# EAGLE design top5v (EAGLE 7.1.0)
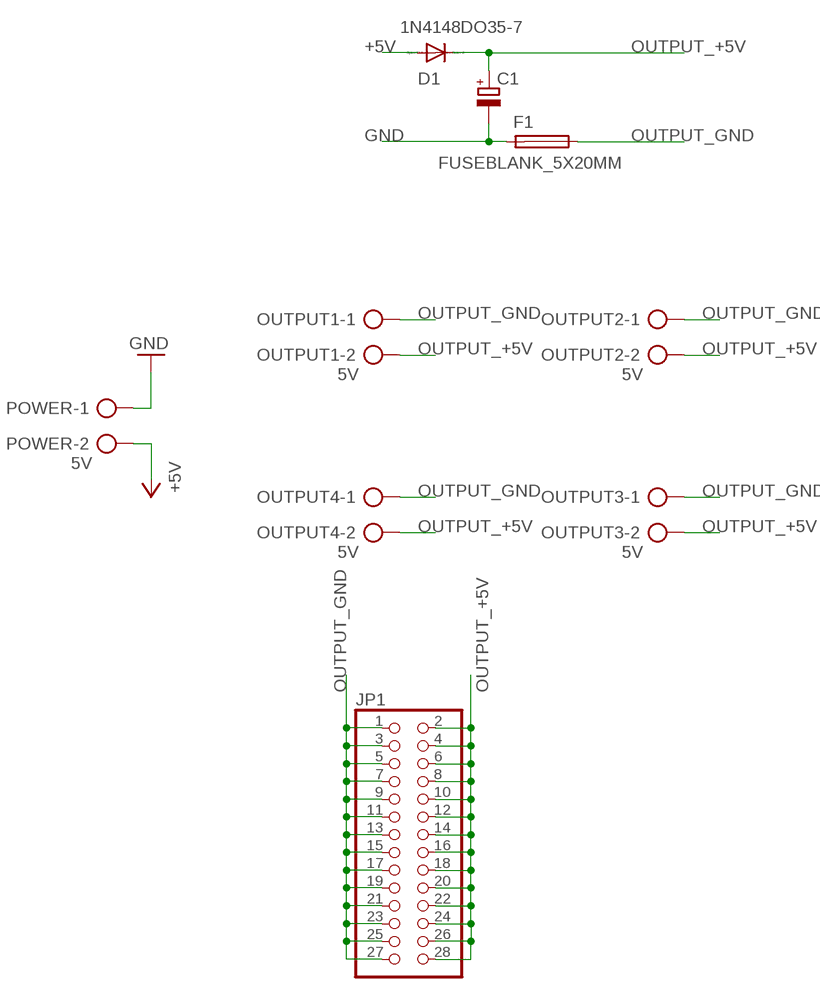
[diagram p0: schematic, sheet 1]

## Parts
C1  CPOL-EUE1.8-4  [E1,8-4]
D1  1N4148DO35-7  [DO35-7]
F1  FUSEBLANK_5X20MM  [FUSE_HOLDER_5X20MM]
JP1  PINHD-2X14  [2X14]
OUTPUT1  5V  AK500/2-H  [AK500/2-H]
OUTPUT2  5V  AK500/2-H  [AK500/2-H]
OUTPUT3  5V  AK500/2-H  [AK500/2-H]
OUTPUT4  5V  AK500/2-H  [AK500/2-H]
POWER  5V  AK500/2-H  [AK500/2-H]

## Nets
+5V: D1.A POWER.2
GND: C1.- F1.2 POWER.1
OUTPUT_+5V: C1.+ D1.C JP1.2 JP1.4 JP1.6 JP1.8 JP1.10 JP1.12 JP1.14 JP1.16 JP1.18 JP1.20 JP1.22 JP1.24 JP1.26 JP1.28 OUTPUT1.2 OUTPUT2.2 OUTPUT3.2 OUTPUT4.2
OUTPUT_GND: F1.1 JP1.1 JP1.3 JP1.5 JP1.7 JP1.9 JP1.11 JP1.13 JP1.15 JP1.17 JP1.19 JP1.21 JP1.23 JP1.25 JP1.27 OUTPUT1.1 OUTPUT2.1 OUTPUT3.1 OUTPUT4.1

## Library data of the parts
C1 = resistor:CPOL-EU: POLARIZED CAPACITOR, European symbol
D1 = diode:1N4148: DIODE high speed (Philips)
F1 = fuse:FUSE: Fuse; OC_FARNELL: unknown; OC_NEWARK: unknown
JP1 = pinhead:PINHD-2X14: PIN HEADER
OUTPUT1-OUTPUT4 POWER = con-ptr500:AK500/2-H: CONNECTOR Aug. 2004 / PTR Meßtechnik: Die Bezeichnung der Serie AK505 wurde geändert. Es handelt sich hierbei um AK500 in horizontaler Ausführung.; OC_FARNELL: unknown; OC_NEWARK: unknown

## Board
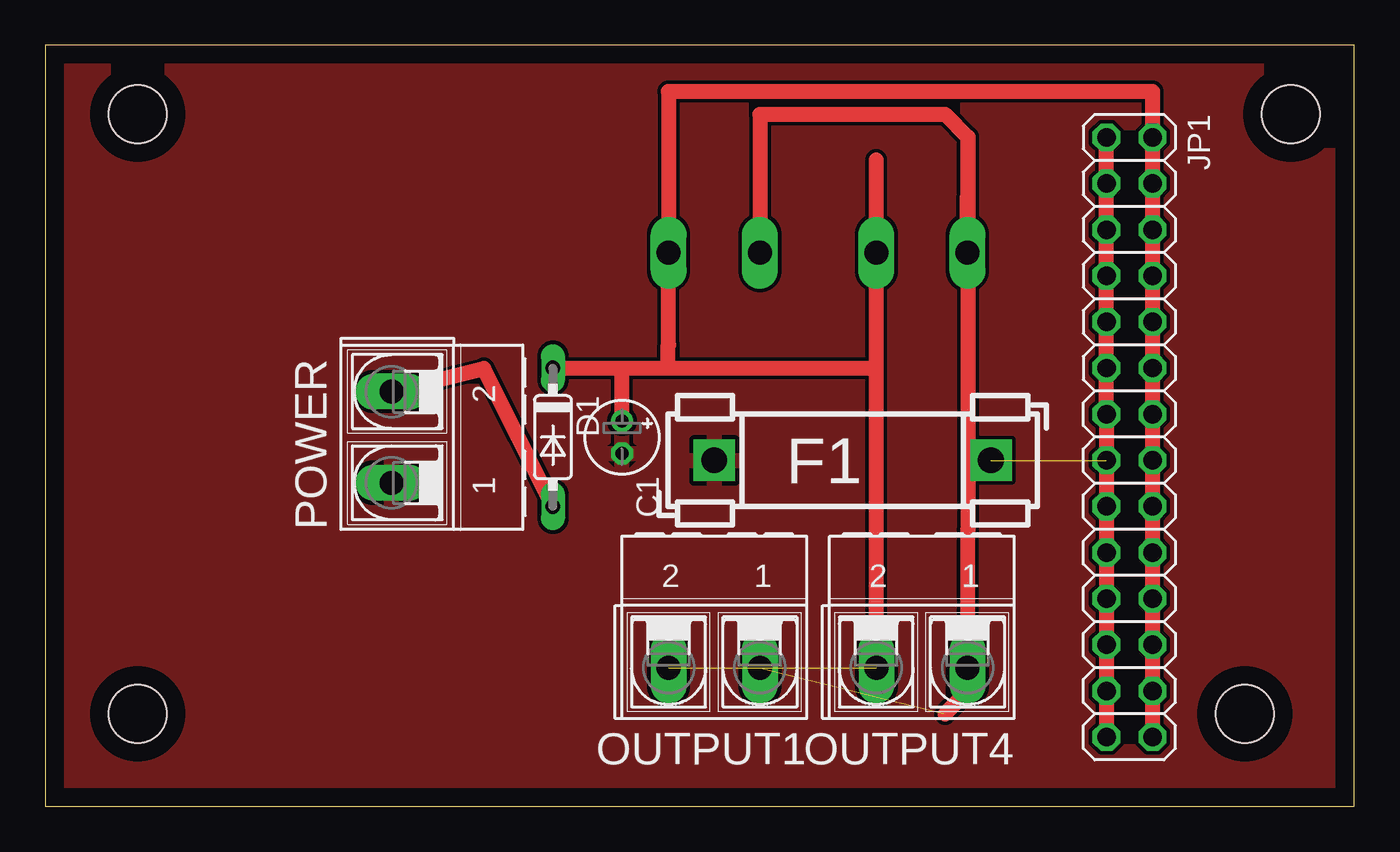
[diagram p1: board, top side]
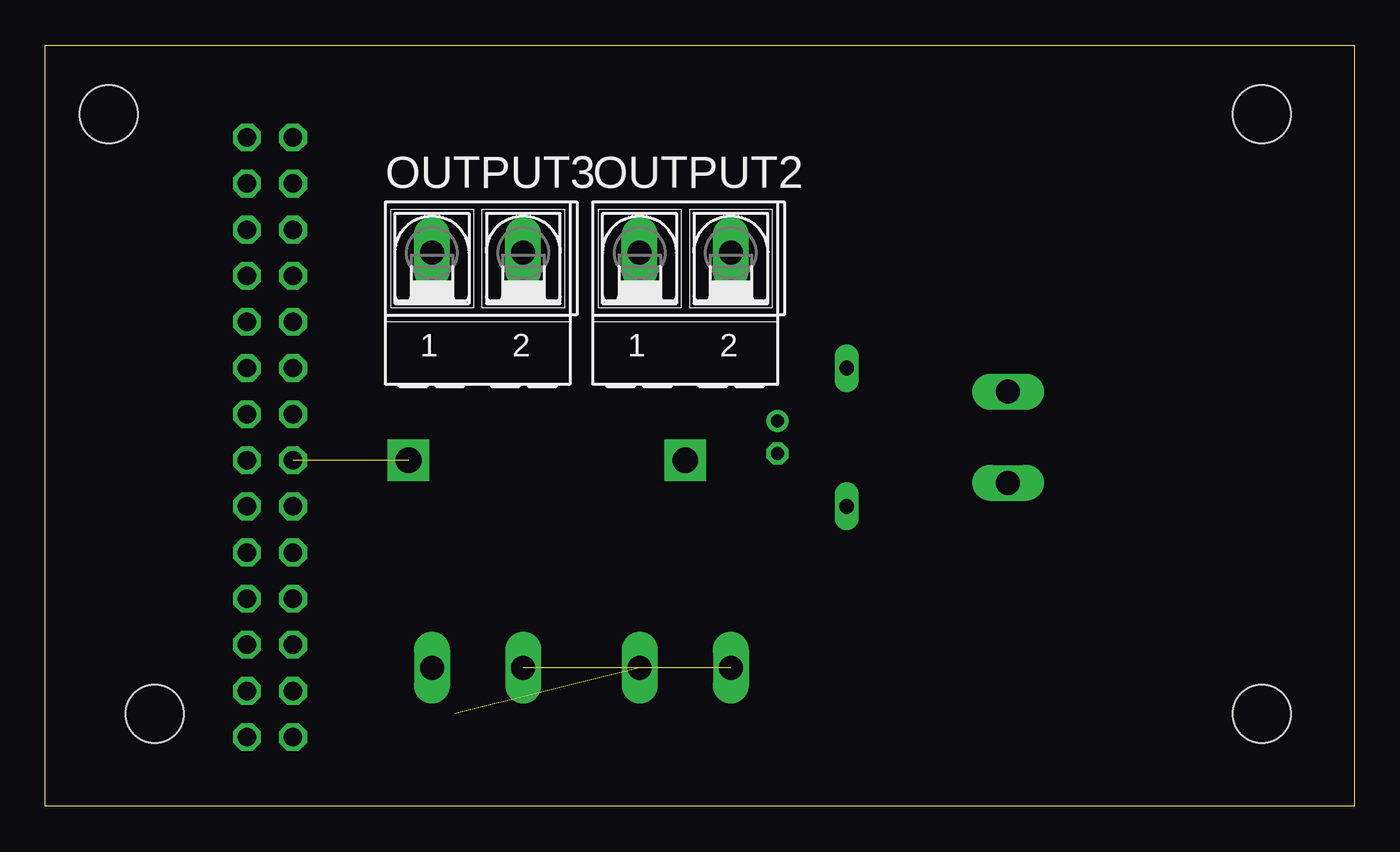
[diagram p2: board, bottom side, seen from below]

Size 72.06 x 41.9 mm. Coordinates in mm from the lower left corner, seen from the top.
Outline: 0,0 72.06,0 72.06,41.9 0,41.9 0,0
Copper layers (1*16): Top 0.035mm / dielectric 1.5mm / Bottom 0.035mm
Design rules "default": minimum track width 10mil, minimum drill 24mil, track to track 8mil, track to pad 8mil, pad to pad 8mil, via to via 8mil, smd to smd 8mil, copper to edge 40mil, drill to drill 8mil, minimum pad ring 10mil, minimum via ring 8mil, stop-mask expansion 4mil, vias tented up to drill 0mil, thermal gap 10mil
Holes 3.2 mm at 5.08,38.1 5.08,5.08 66.04,5.08 68.58,38.1

### Footprints (pad centres in the part's own frame; a part is rotated, then mirrored left to right if it is on the bottom)
E1,8-4 = drill 0.711 pad 1.168: + -0.889,0 | drill 0.711 pad 1.168 octagon: - 0.889,0
DO35-7 = drill 0.813 long: A 3.81,0; C -3.81,0
FUSE_HOLDER_5X20MM = drill 1.422 pad 2.286 square: 1 0,0; 2 15.24,0
2X14 = drill 1.016 octagon: 1 -16.51,-1.27; 2 -16.51,1.27; 3 -13.97,-1.27; 4 -13.97,1.27; 5 -11.43,-1.27; 6 -11.43,1.27; 7 -8.89,-1.27; 8 -8.89,1.27; 9 -6.35,-1.27; 10 -6.35,1.27; 11 -3.81,-1.27; 12 -3.81,1.27; 13 -1.27,-1.27; 14 -1.27,1.27; 15 1.27,-1.27; 16 1.27,1.27; 17 3.81,-1.27; 18 3.81,1.27; 19 6.35,-1.27; 20 6.35,1.27; 21 8.89,-1.27; 22 8.89,1.27; 23 11.43,-1.27; 24 11.43,1.27; 25 13.97,-1.27; 26 13.97,1.27; 27 16.51,-1.27; 28 16.51,1.27
AK500/2-H = drill 1.321 long: 1 -2.515,0; 2 2.515,0

### Placement (x,y rotation side)
C1  31.75,20.32 270 top
D1  27.94,20.32 270 top
F1  52.07,19.05 180 top
JP1  59.69,20.32 270 top
OUTPUT1  36.83,7.62 180 top
OUTPUT2  36.83,30.48 0 bottom
OUTPUT3  48.26,30.48 0 bottom
OUTPUT4  48.26,7.62 180 top
POWER  19.05,20.32 90 top

### Tracks (layer width: path | path; a pad name or v marks a point on that pad's centre or on a via)
+5V
  Top 0.813: POWER.2 24.13,24.11 D1.A
GND
  pour Top: -10.16,46.99 76.2,46.99 76.2,-17.78 -10.16,-17.78
OUTPUT_+5V  (1 unrouted)
  Top 0.813: D1.C 31.75,24.13 | 31.75,24.13 34.29,24.13 | 34.29,24.13 34.29,25.4 34.31,25.4 OUTPUT2.2 34.31,39.37 | 45.72,24.13 45.72,6.38 OUTPUT4.2 | 45.74,35.59 OUTPUT3.2 45.74,24.16 45.72,24.13 | 34.29,24.13 45.72,24.13 | 34.31,39.37 60.96,39.37 JP1.2 JP1.4 JP1.6 JP1.8 JP1.10 JP1.12 JP1.14 JP1.16 JP1.18 JP1.20 JP1.22 JP1.24 JP1.26 JP1.28 | 34.29,39.37 34.31,39.37 | C1.+ 31.75,24.13
OUTPUT_GND  (2 unrouted)
  Top 0.813: 49.53,5.08 50.77,6.33 OUTPUT4.1 50.77,15.21 50.8,15.24 50.8,19.05 | 50.8,19.05 50.8,36.8 OUTPUT3.1 50.8,36.85 50.8,36.83 49.53,38.1 39.34,38.1 OUTPUT2.1 | JP1.1 JP1.3 JP1.5 JP1.7 JP1.9 JP1.11 JP1.13 JP1.15 JP1.17 JP1.19 JP1.21 JP1.23 JP1.25 JP1.27 | F1.1 50.8,19.05